# EAGLE design 12vTo5vPowerSupplyBoard (EAGLE 9.6.2)
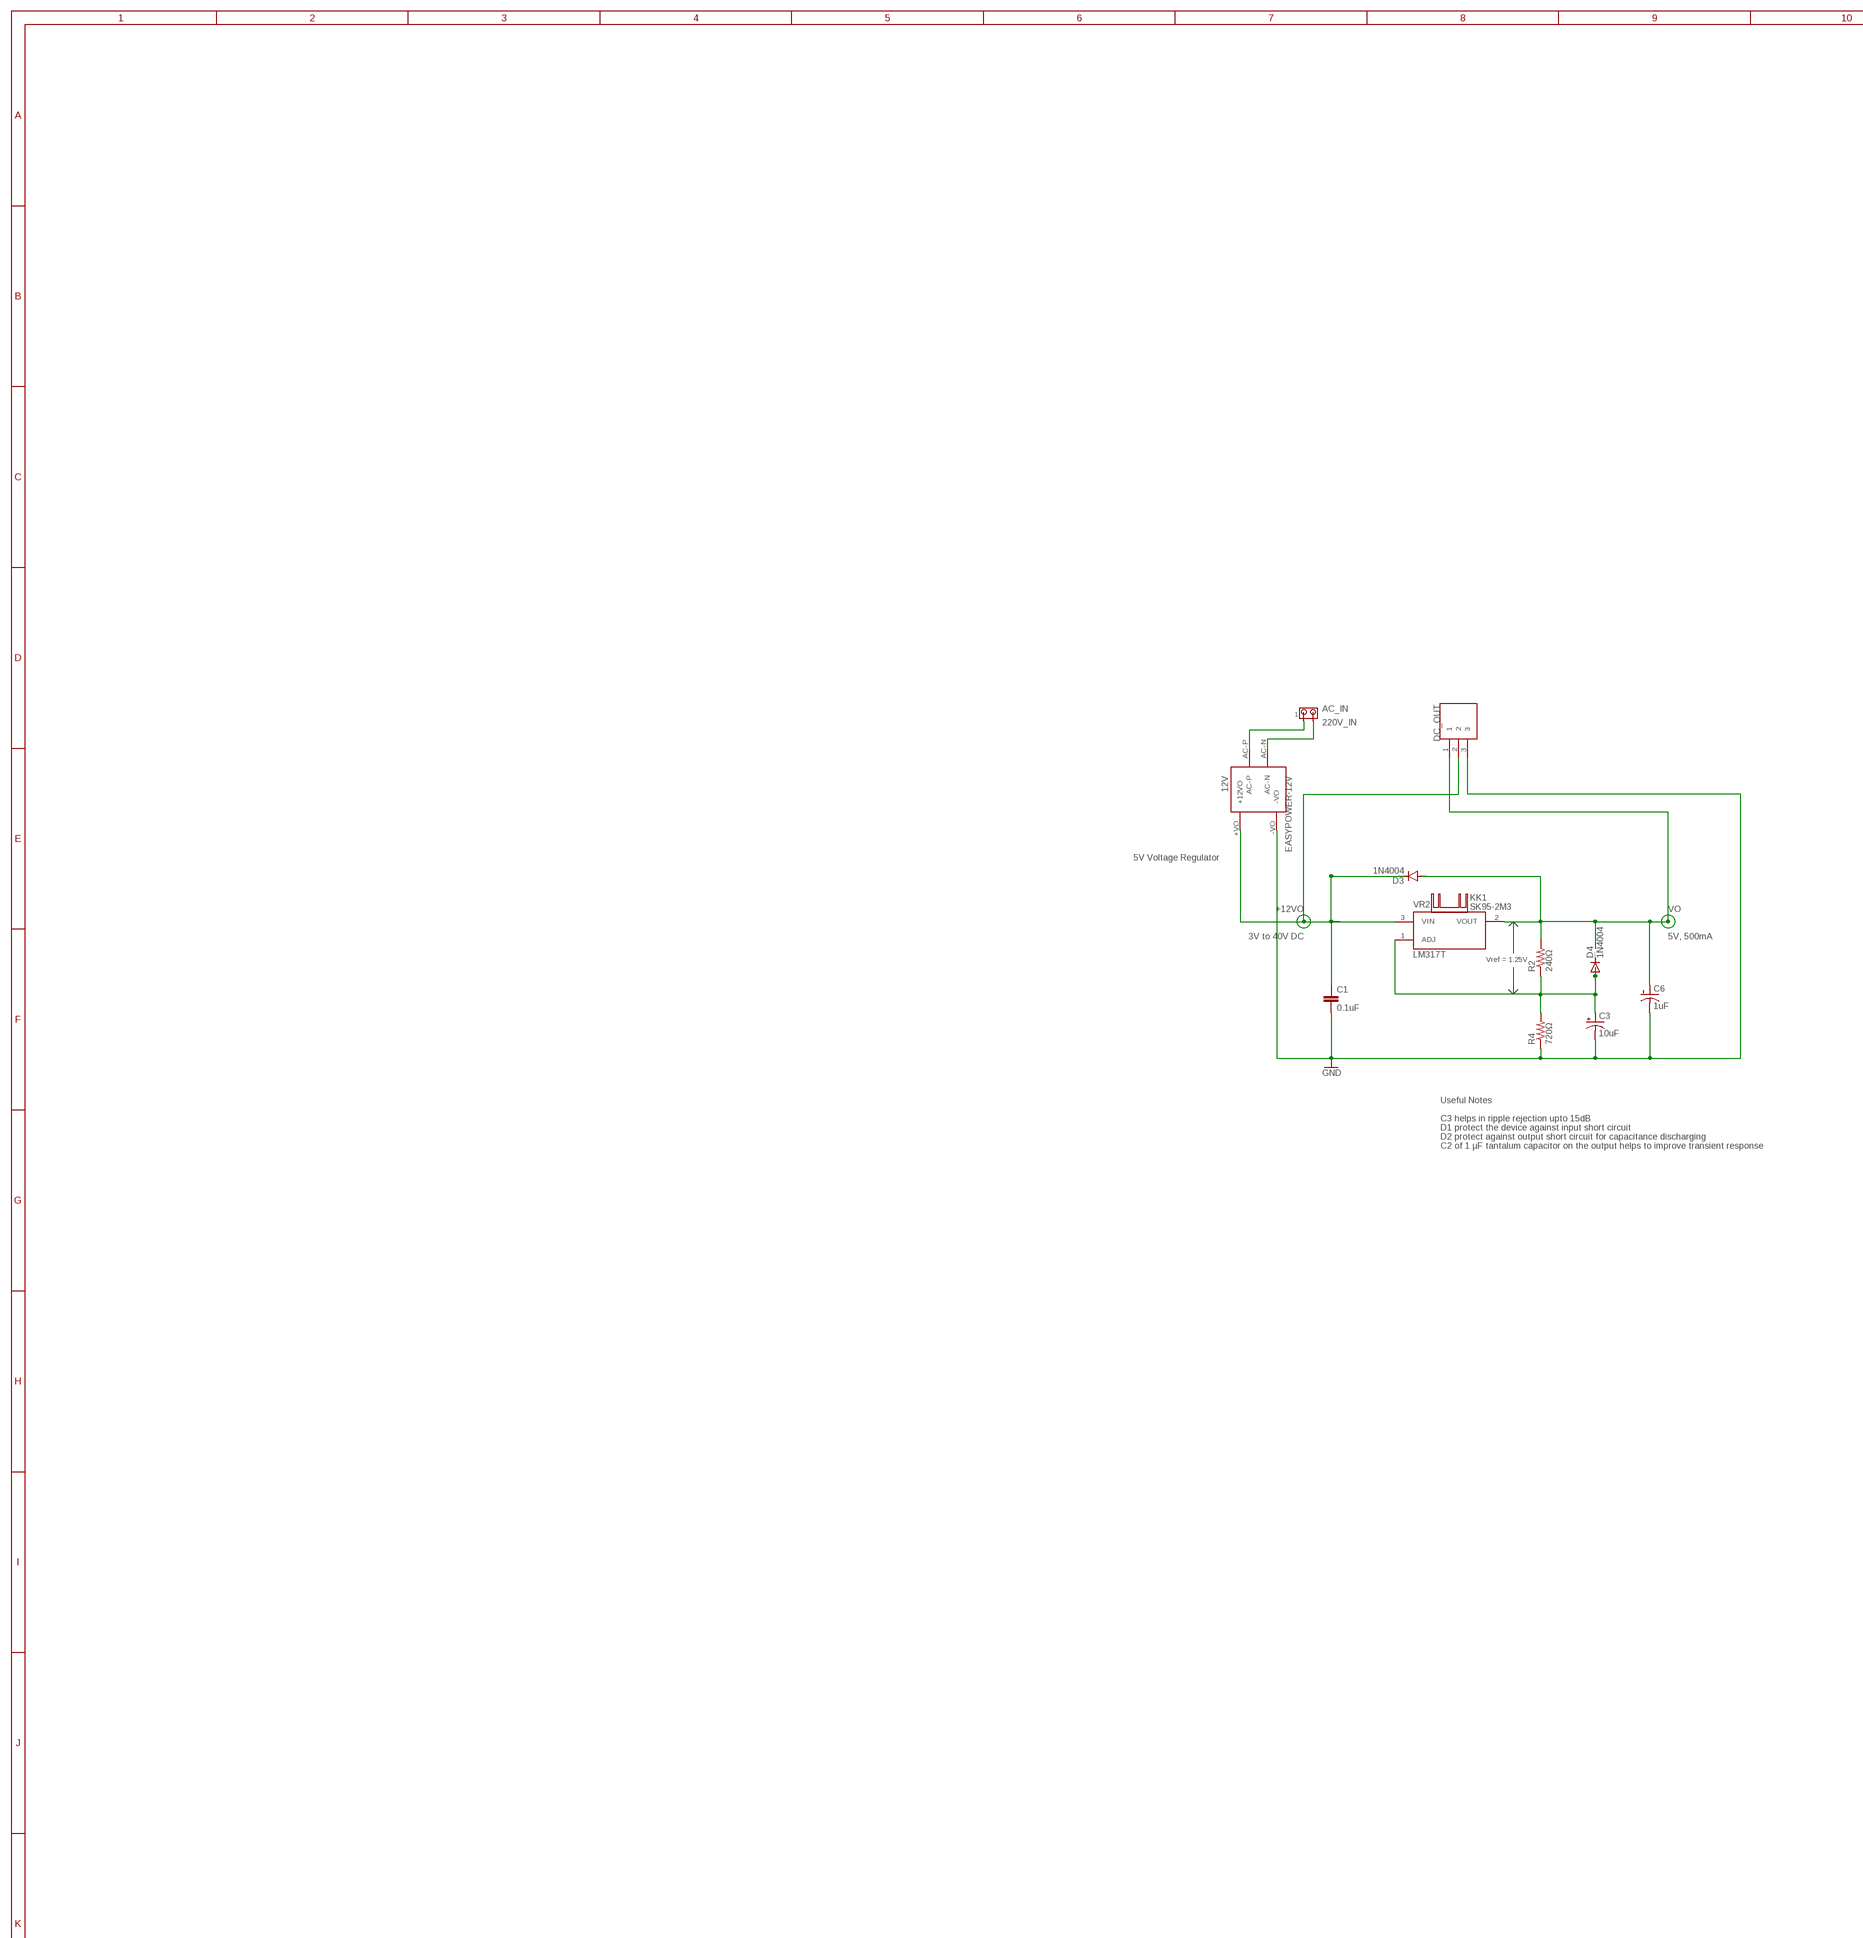
[diagram p0: schematic, sheet 1, part 1 of 3]
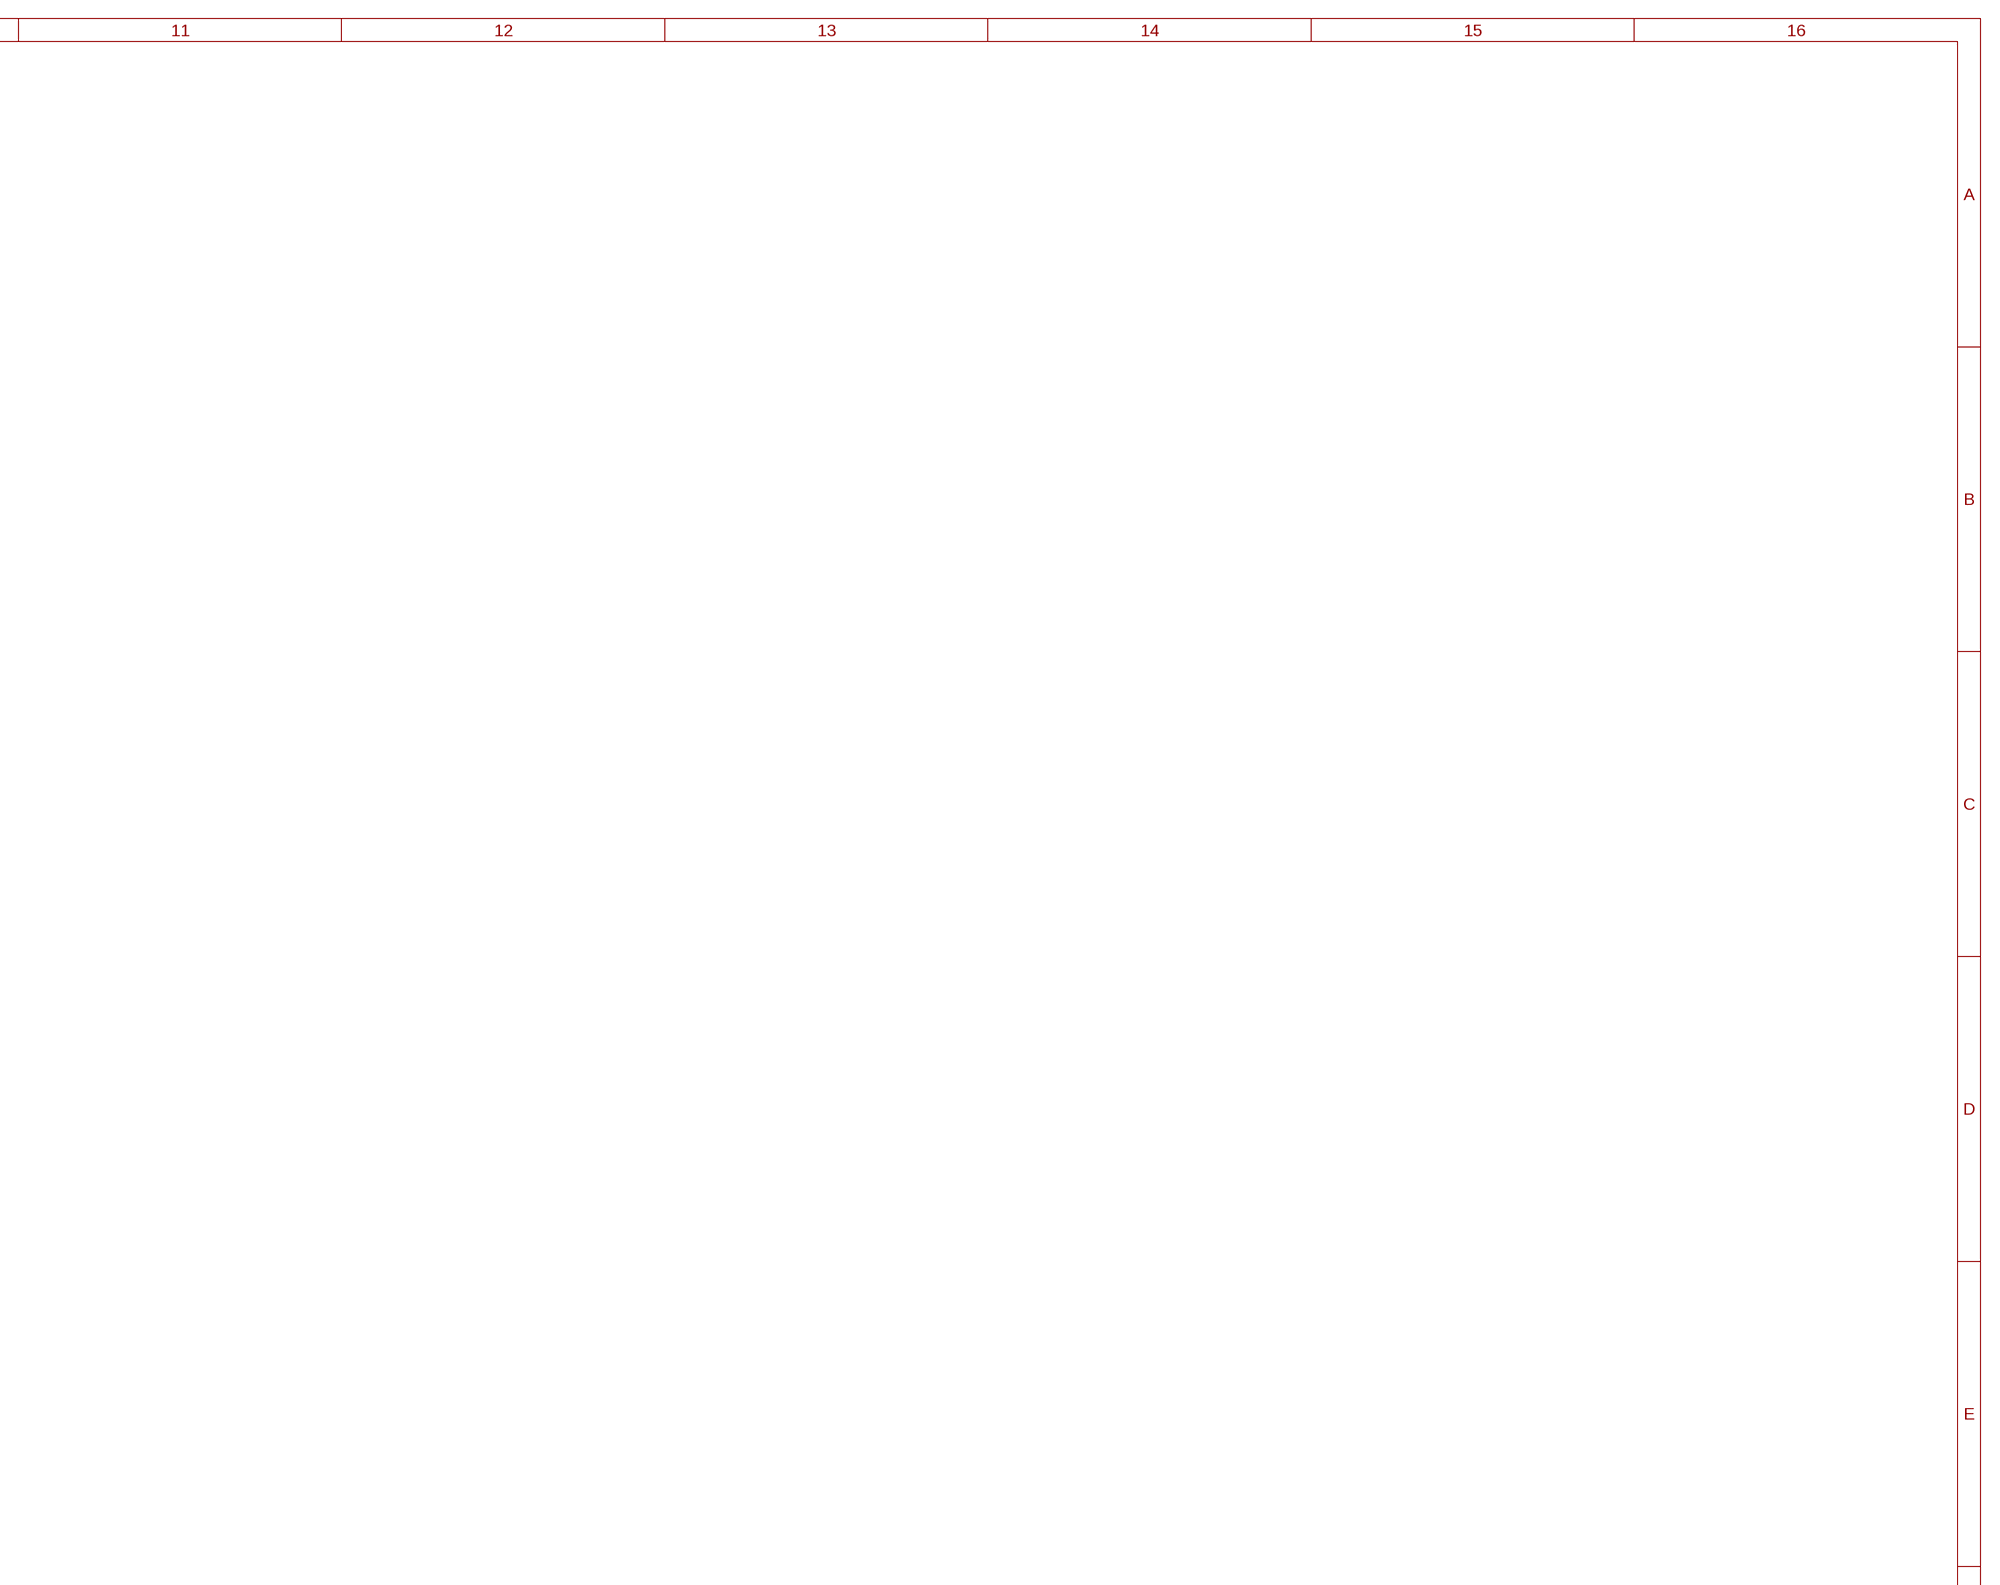
[diagram p1: schematic, sheet 1, part 2 of 3]
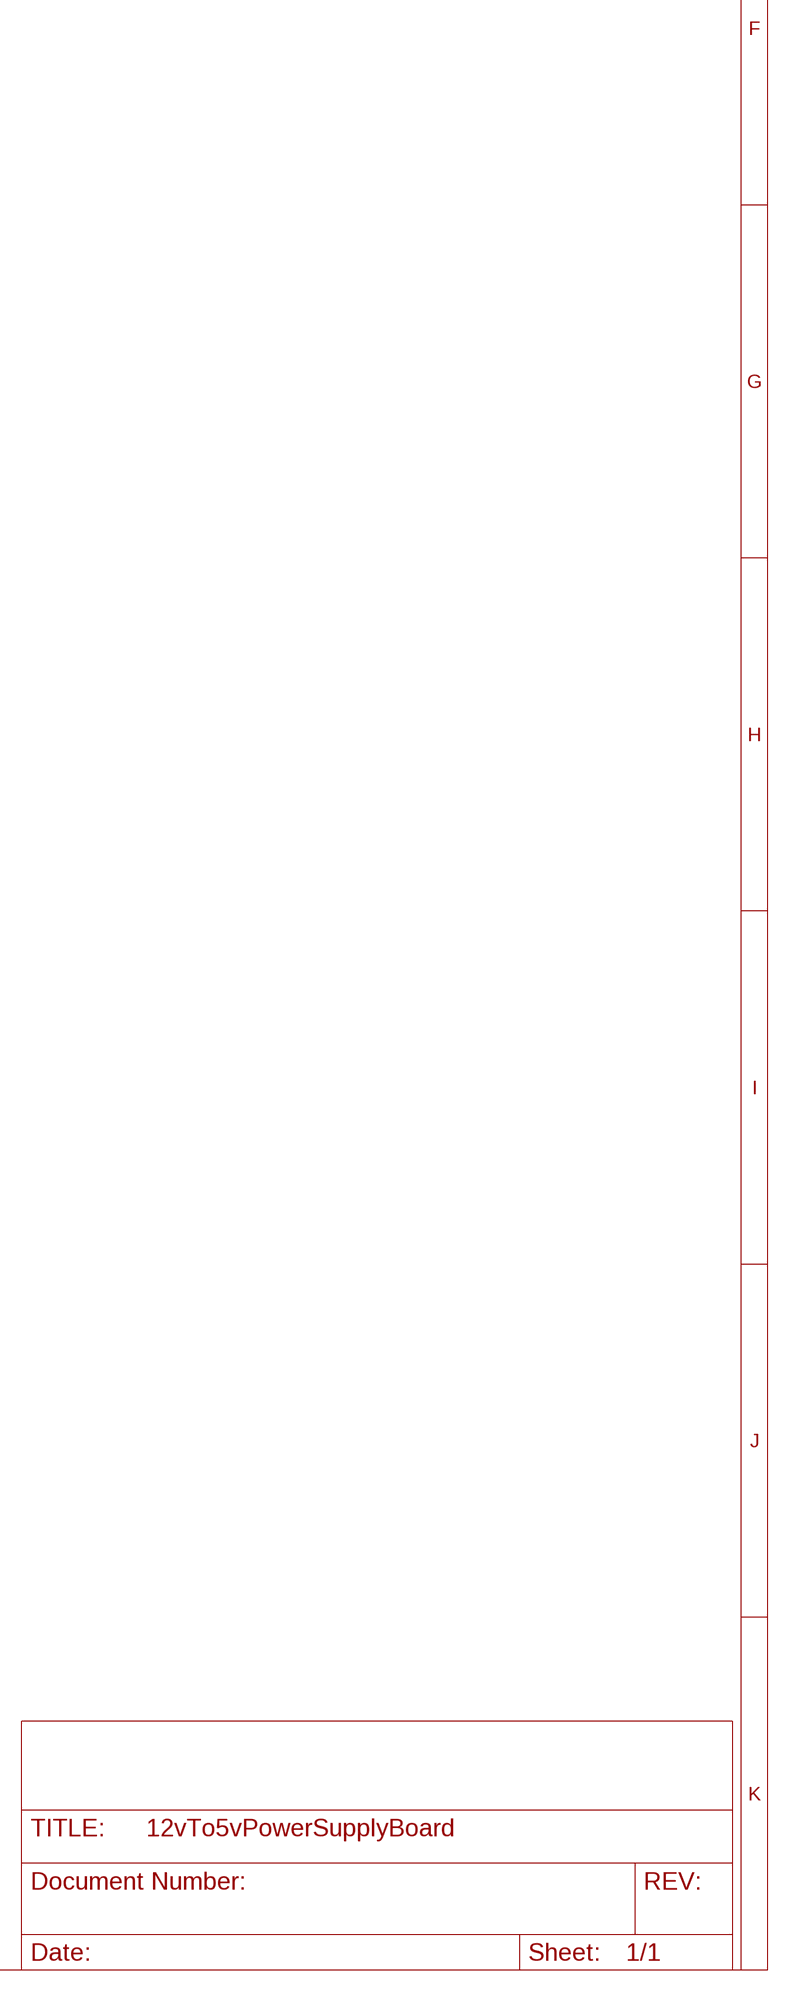
[diagram p2: schematic, sheet 1, part 3 of 3]

## Parts
AC_IN  220V_IN  MTA02-156  [1X2MTA]
C1  0.1uF  C2.5/2  [C2.5-2]
C3  10uF  CPOL-USE2.5-5  [E2,5-5]
C6  1uF  CPOL-USE2.5-5  [E2,5-5]
D3  1N4004  [DO41-10]
D4  1N4004  [DO41-10]
DC_OUT  440052-3  [TE_440052-3]
EASYPOWER-12V  12V  SO12V200  [SO12V200]
KK1  SK95-2M3  [SK95-2M3]
R2  240Ω  R-US_0204/2V  [0204V]
R4  720Ω  R-US_0204/2V  [0204V]
VR2  LM317T  [TO254P1054X470X1955-3]

## Nets
+12VO: C1.1 D3.C DC_OUT.2 EASYPOWER-12V.+VO(+12VO) VR2.3(VIN)
GND: C1.2 C3.- C6.- DC_OUT.3 EASYPOWER-12V.-VO R4.1
N$3 [AC_VOLTAGE]: AC_IN.1 EASYPOWER-12V.AC-P
N$4 [AC_VOLTAGE]: AC_IN.2 EASYPOWER-12V.AC-N
N$6: C3.+ D4.A R2.1 R4.2 VR2.1(ADJ)
VO: C6.+ D3.A DC_OUT.1 R2.2 VR2.2(VOUT)
Unconnected: D4.C

## Notes on the sheet
- 5V Voltage Regulator
- 3V to 40V DC | 5V, 500mA
- Vref = 1.25V
- Useful Notes
- C3 helps in ripple rejection upto 15dB
- D1 protect the device against input short circuit
- D2 protect against output short circuit for capacitance discharging
- C2 of 1 µF tantalum capacitor on the output helps to improve transient response

## Library data of the parts
AC_IN = con-amp:MTA02-156: AMP connector
C1 = capacitor-wima:C: CAPACITOR naming: grid - package width
C3 C6 = rcl:CPOL-US: POLARIZED CAPACITOR, American symbol; SPICEPREFIX: C
D3 D4 = diode:1N4004: DIODE general purpose rectifier, 1 A
DC_OUT = 440052-3:440052-3: Check availability <https://pricing.snapeda.com/parts/440052-3/TE%20Connectivity/view-part?ref=eda>; AVAILABILITY: In Stock; CENTERLINE_PITCH: 2.5 mm[.098 in]; COMMENT: 440052-3; DESCRIPTION: 2.5MM,HDR,3POS,VERTICAL, CONNECTOR; EU_ROHS_COMPLIANCE: Compliant; MF: TE Connectivity; MP: 440052-3; NUMBER_OF_POSITIONS: 3; PACKAGE: None; PRICE: None; PRODUCT_TYPE: Connector; PURCHASE-URL: https://pricing.snapeda.com/search/part/440052-3/?ref=eda
EASYPOWER-12V = easypower:SO12V200: This is the EasyPower 12V 300mA micro SMPS. Input 220-230V AC and Output is 12V DC with a load of 300mA
KK1 = heatsink:SK95-2M3: HEATSINK manufacturer Fischer/distributor Buerklin
R2 R4 = rcl:R-US_: RESISTOR, American symbol; SPICEPREFIX: R
VR2 = LM317T:LM317T: Standard Regulator Pos 1.2V to 37V 0.4A 3-Pin(3+Tab) TO-220 Rail; AVAILABILITY: Unavailable; DESCRIPTION: Standard Regulator Pos 1.2V to 37V 0.4A 3-Pin_3+Tab_ TO-220 Rail; MF: Texas Instruments; MP: LM317T; PACKAGE: TO-220-3 HTC Korea; PRICE: None

## Net classes
0 default: width 0.813 mm
1 AC_VOLTAGE: width 1.626 mm

## Board
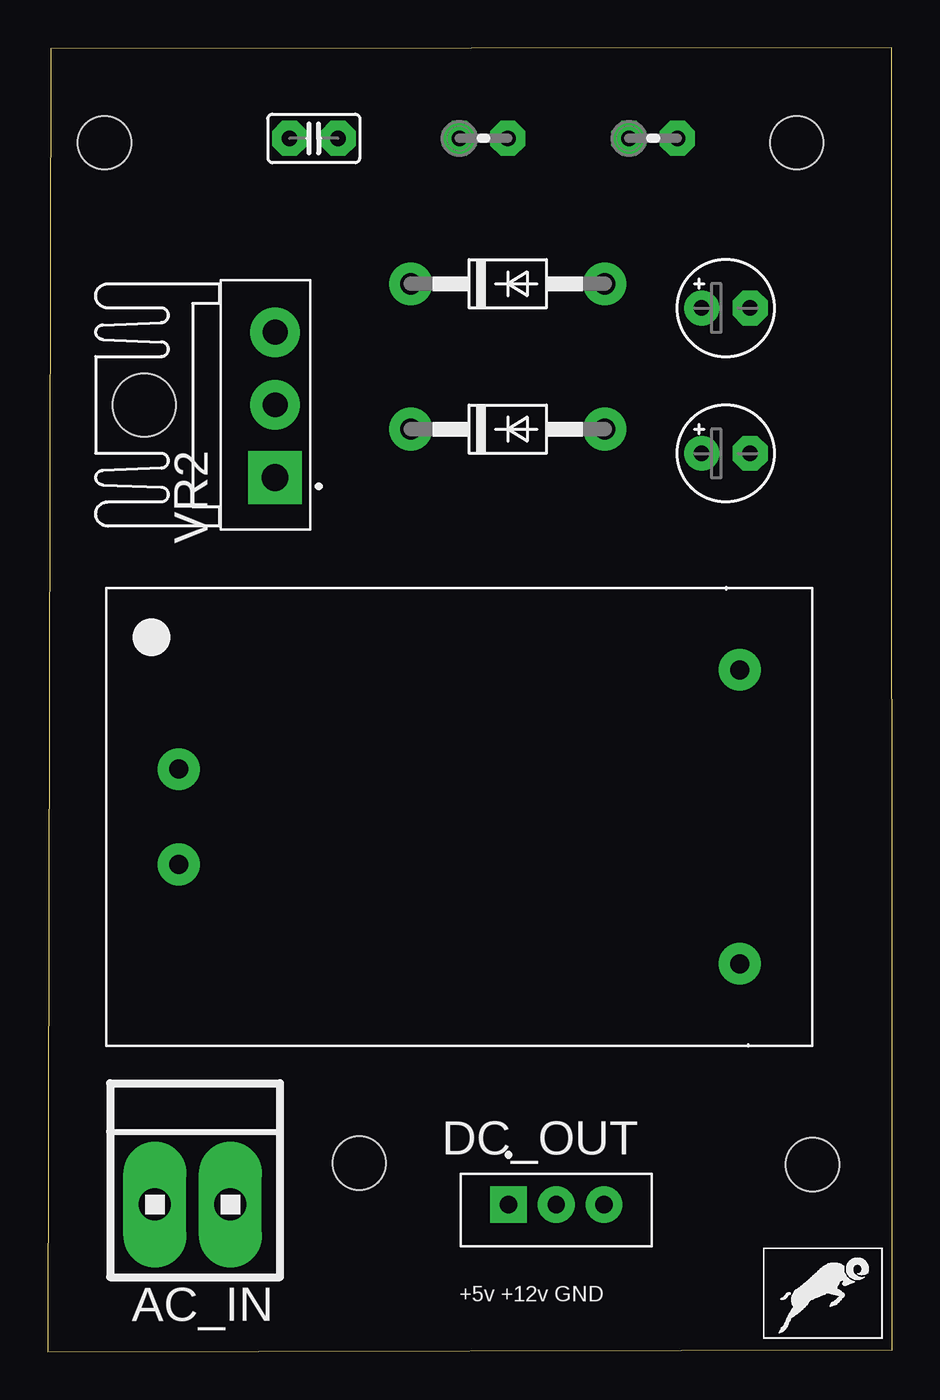
[diagram p3: board, top side]
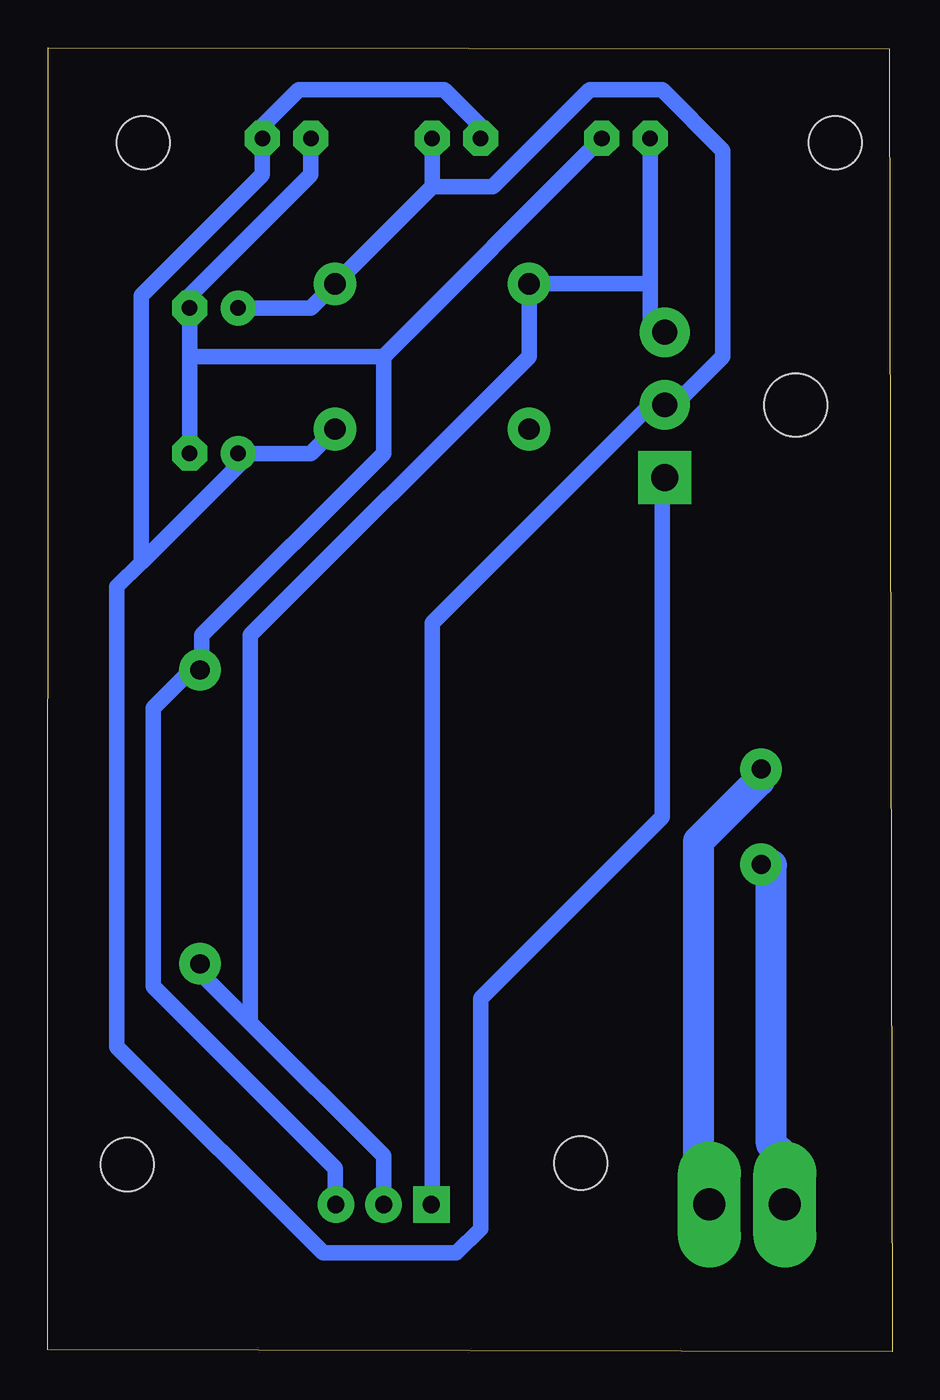
[diagram p4: board, bottom side, seen from below]

Size 44.24 x 68.36 mm. Coordinates in mm from the lower left corner, seen from the top.
Outline: 0,0 44.24,0.1 44.22,68.36 0.15,68.3 0,0
Copper layers (1*16): Top 0.035mm / dielectric 1.5mm / Bottom 0.035mm
Design rules "PCB_at_home": minimum track width 32mil, minimum drill 8mil, track to track 8mil, track to pad 8mil, pad to pad 8mil, via to via 8mil, smd to smd 8mil, copper to edge 8mil, drill to drill 8mil, minimum pad ring 20mil, minimum via ring 20mil, stop-mask expansion 2mil, vias tented up to drill 20mil, thermal gap 10mil
Holes 2.79 mm at 40.07,9.81 39.24,63.37 2.97,63.37 16.32,9.89

### Footprints (pad centres in the part's own frame; a part is rotated, then mirrored left to right if it is on the bottom)
1X2MTA = drill 1.676 long: 1 1.981,0; 2 -1.981,0
C2.5-2 = drill 0.813 pad 1.6 octagon: 1 -1.27,0; 2 1.27,0
E2,5-5 = drill 0.813 pad 1.6: + -1.27,0 | drill 0.813 pad 1.6 octagon: - 1.27,0
DO41-10 = drill 1.118: A 5.08,0; C -5.08,0
TE_440052-3 = drill 0.9 square: 1 -2.5,0 | drill 0.9: 2 0,0; 3 2.5,0
SO12V200 = drill 1 pad 2.184: +VO 14.7,-7.7; -VO 14.7,7.7; AC-N -14.7,-2.5; AC-P -14.7,2.5
SK95-2M3 = hole 3.302: 0,2.54
0204V = drill 0.813 octagon: 1 -1.27,0; 2 1.27,0
TO254P1054X470X1955-3 = drill 1.4 pad 2.184 square: 1 -2.54,-0.51 | drill 1.3 pad 2.184: 2 1.27,-0.51; 3 5.08,-0.51

### Placement (x,y rotation side)
AC_IN  7.59,7.72 0 top
C1  13.94,63.6 0 top
C3  35.53,47.09 0 top
C6  35.53,54.71 0 top
D3  24.1,55.98 0 top
D4  24.1,48.36 0 top
DC_OUT  26.64,7.72 0 top
EASYPOWER-12V  21.56,28.04 0 top
KK1  7.59,49.63 90 top
R2  22.83,63.6 0 top
R4  31.72,63.6 0 top
VR2  11.4,48.36 90 top

### Tracks (layer width: path | path; a pad name or v marks a point on that pad's centre or on a via)
+12VO
  Bottom 0.813: 12.67,55.98 12.67,54.08 12.04,53.44 VR2.3 | 12.67,55.98 C1.1 | 12.67,55.98 D3.C 19.02,52.17 33.63,37.57 33.63,17.25 | DC_OUT.2 26.64,10.26 33.63,17.25 | 33.63,17.25 36.17,19.79 EASYPOWER-12V.+VO
GND
  Bottom 0.813: DC_OUT.3 29.18,7.72 29.18,9.63 38.71,19.15 38.71,33.76 36.8,35.66 EASYPOWER-12V.-VO 36.17,36.3 36.17,37.57 26.64,47.09 26.64,52.17 | 36.8,52.17 C6.- 36.8,55.35 30.45,61.7 R4.1 | 36.8,52.17 C3.- | 26.64,52.17 C1.2 | 36.8,52.17 26.64,52.17
N$3
  Bottom 1.626: EASYPOWER-12V.AC-P 6.96,29.95 10.13,26.77 10.13,7.72 AC_IN.1
N$4
  Bottom 1.626: EASYPOWER-12V.AC-N 6.32,25.5 6.32,10.9 5.69,10.26 5.69,7.72 AC_IN.2
N$6
  Bottom 0.813: R2.1 21.56,64.24 23.47,66.14 31.09,66.14 32.99,64.24 R4.2 32.99,61.7 39.34,55.35 39.34,41.38 | 33.63,47.09 30.45,47.09 D4.A | 33.63,47.09 39.34,41.38 | 39.34,41.38 40.61,40.11 40.61,15.98 29.82,5.18 22.83,5.18 21.56,6.45 21.56,18.52 12.04,28.04 12.04,45.82 VR2.1 | 33.63,47.09 C3.+
VO
  Bottom 0.813: 24.1,61.06 R2.2 | 24.1,61.06 D3.A 30.45,54.71 C6.+ | DC_OUT.1 24.1,7.72 24.1,38.2 12.67,49.63 VR2.2 11.4,49.63 8.86,52.17 8.86,62.97 12.04,66.14 15.85,66.14 20.93,61.06 24.1,61.06

### Text on the board
tNames: +5v +12v GND